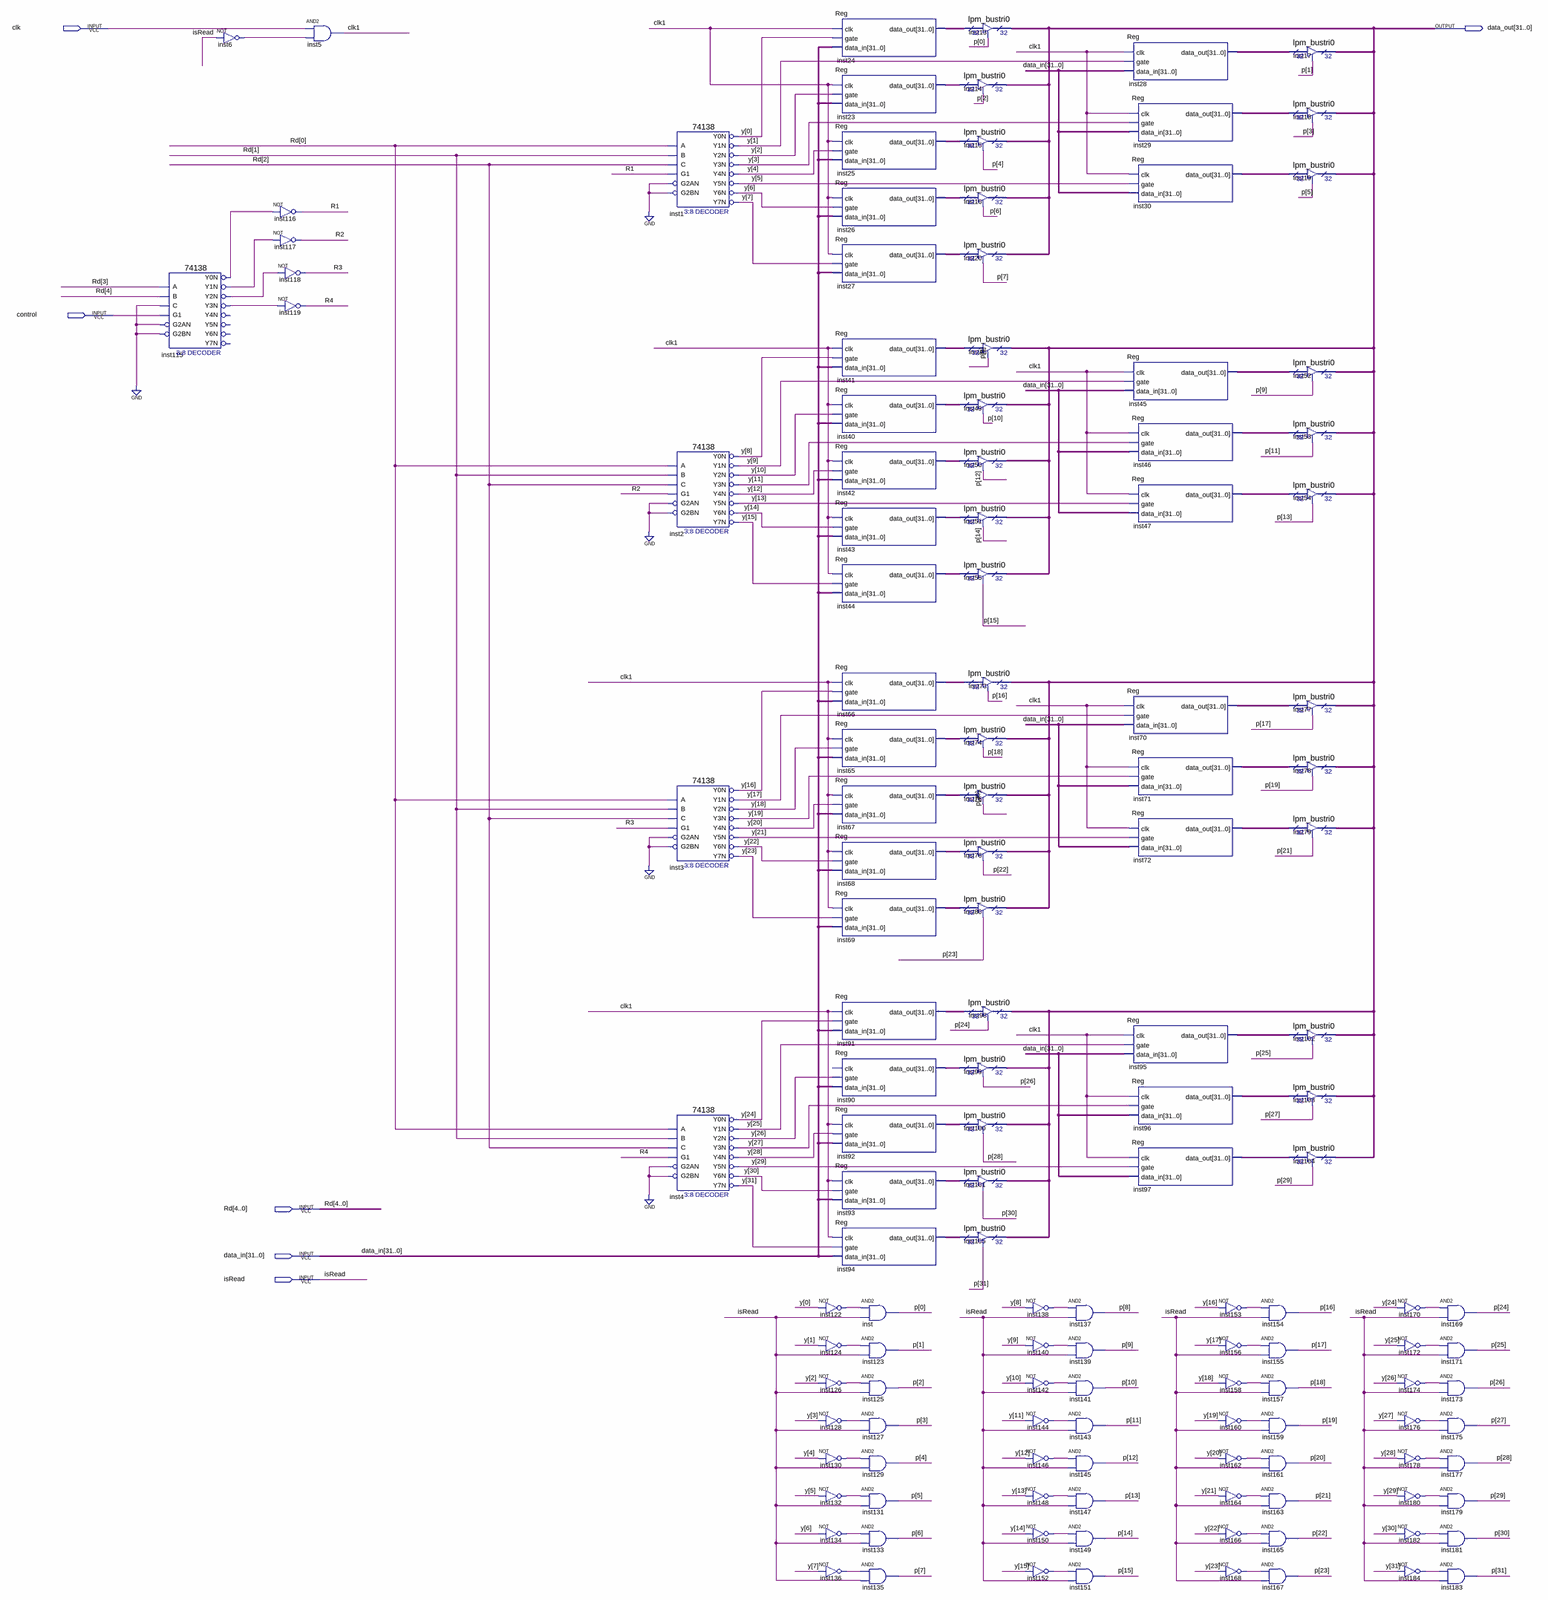
[diagram p0: schematic sheet, whole]
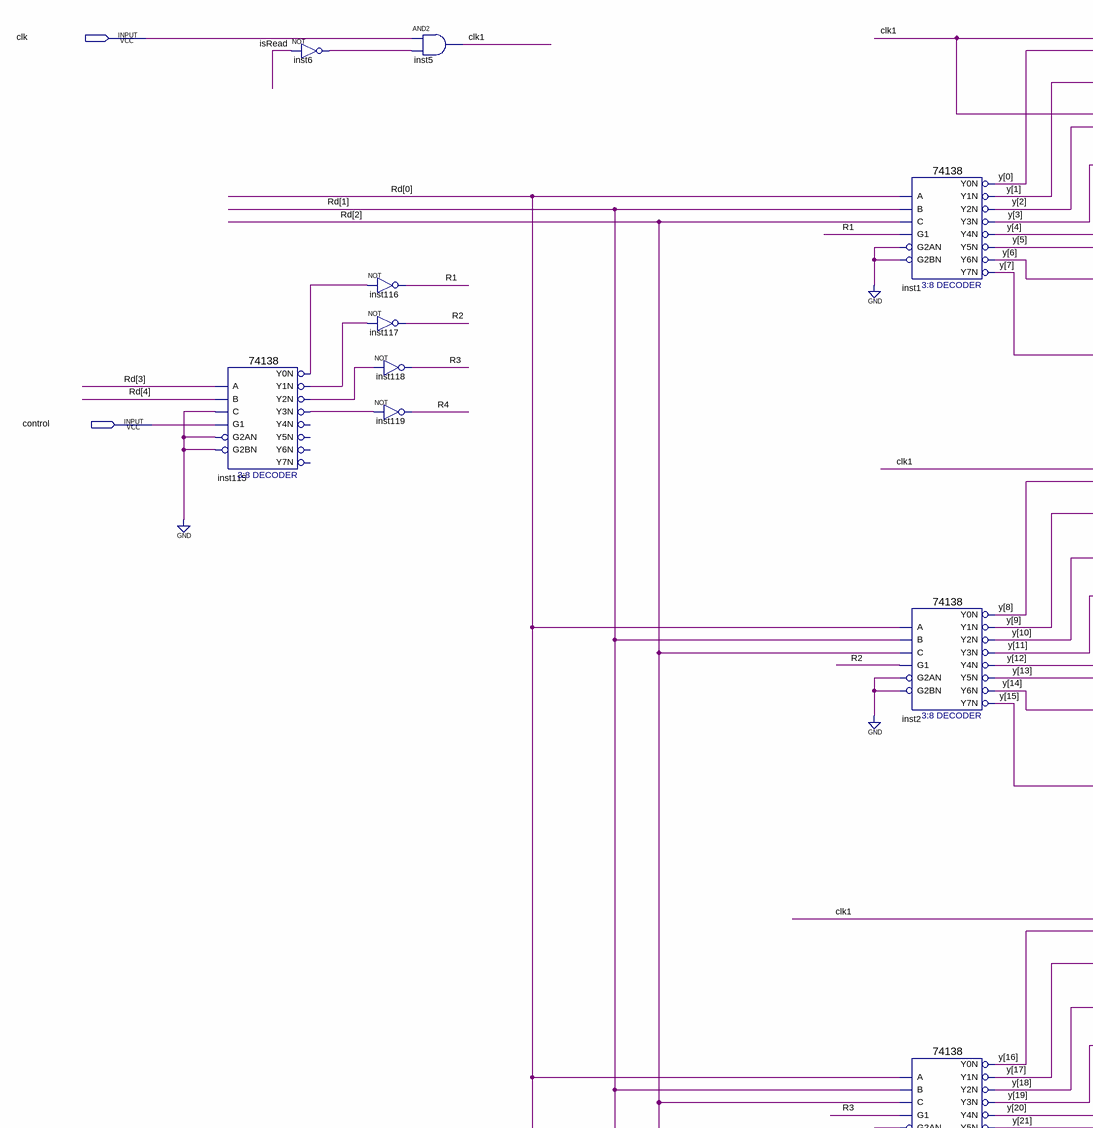
[diagram p1: schematic sheet, upper left part]
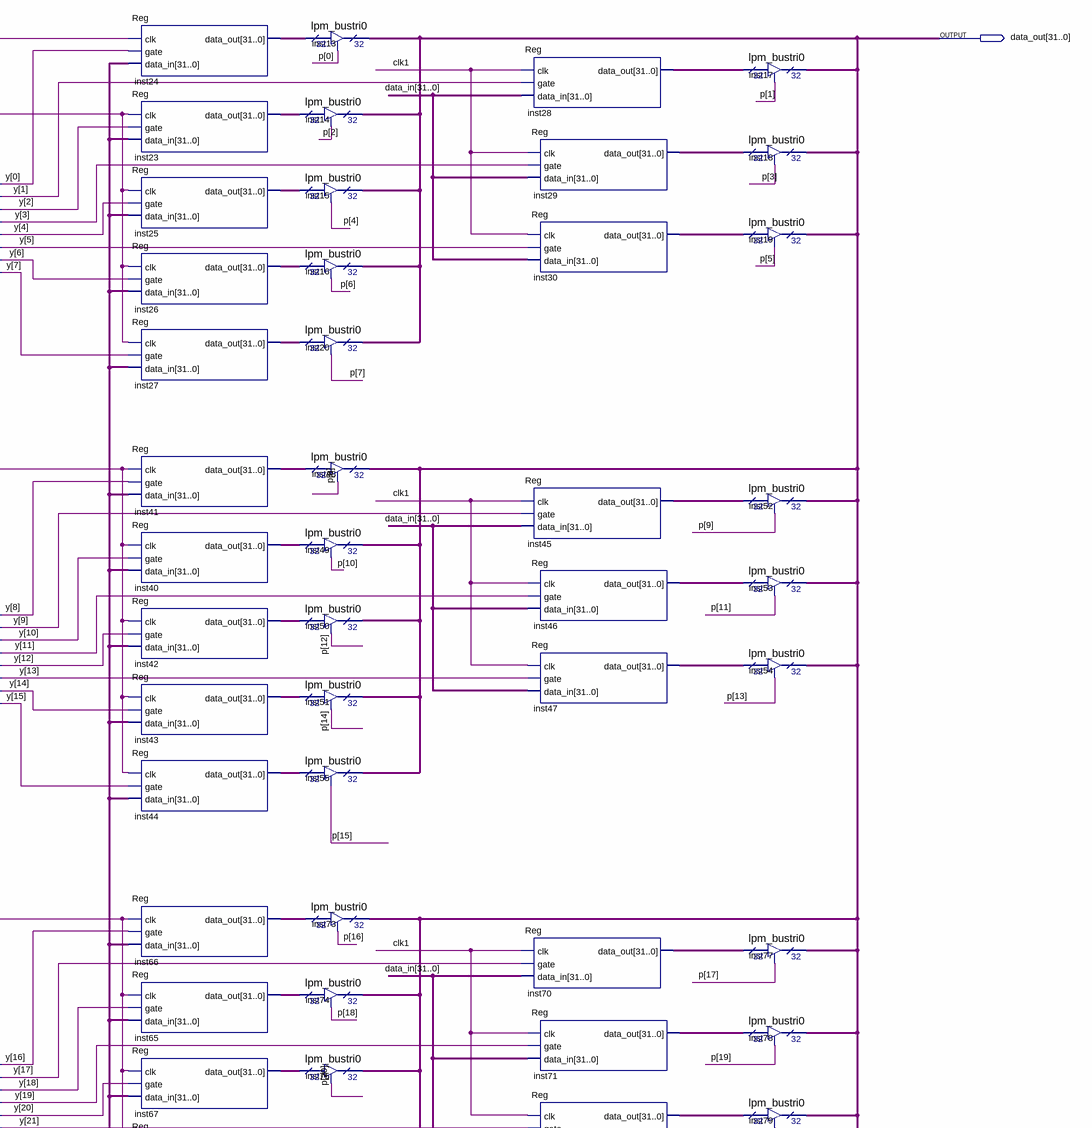
[diagram p2: schematic sheet, upper right part]
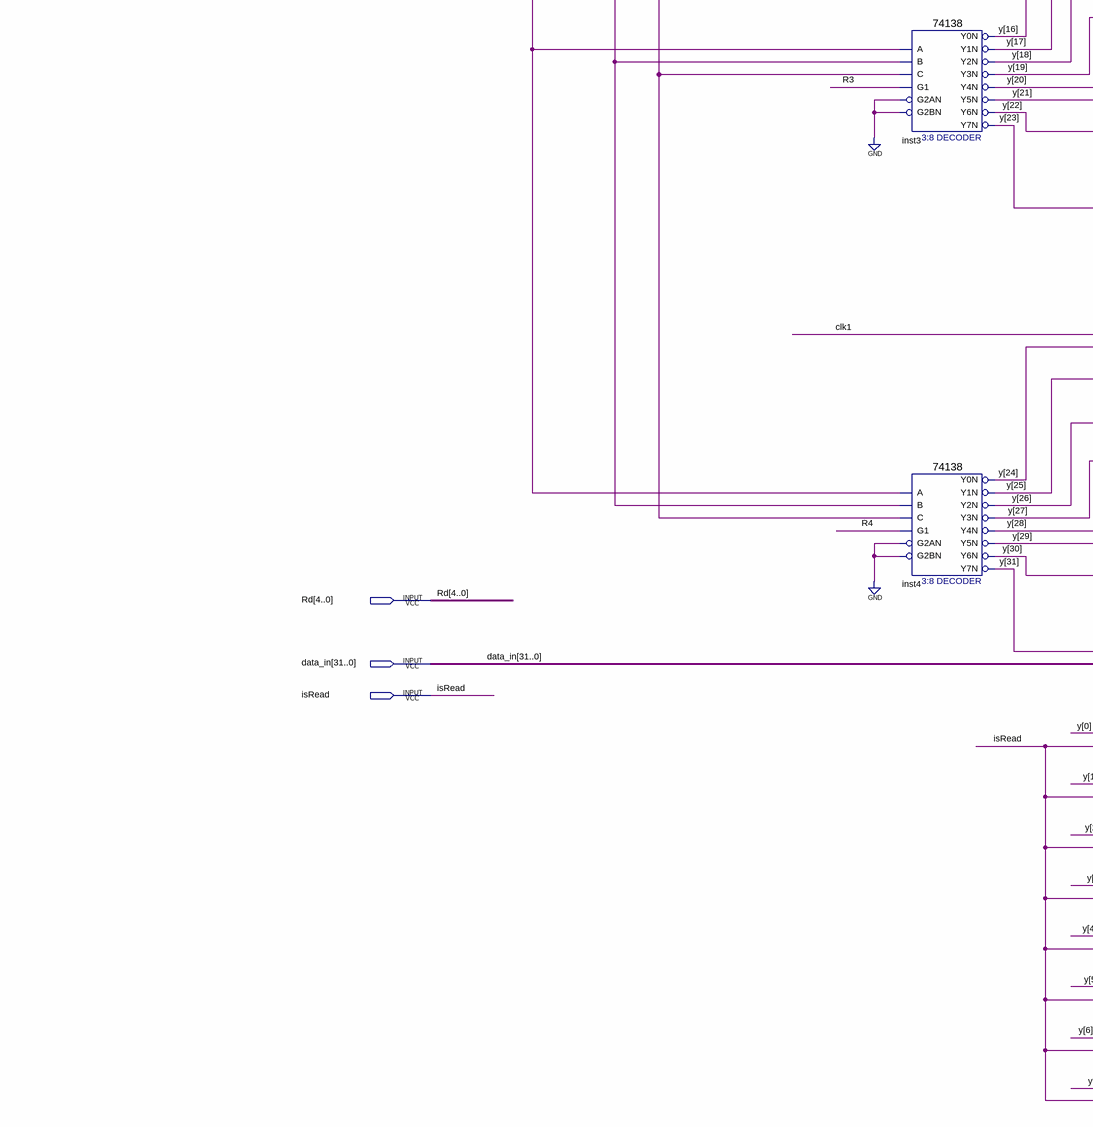
[diagram p3: schematic sheet, lower left part]
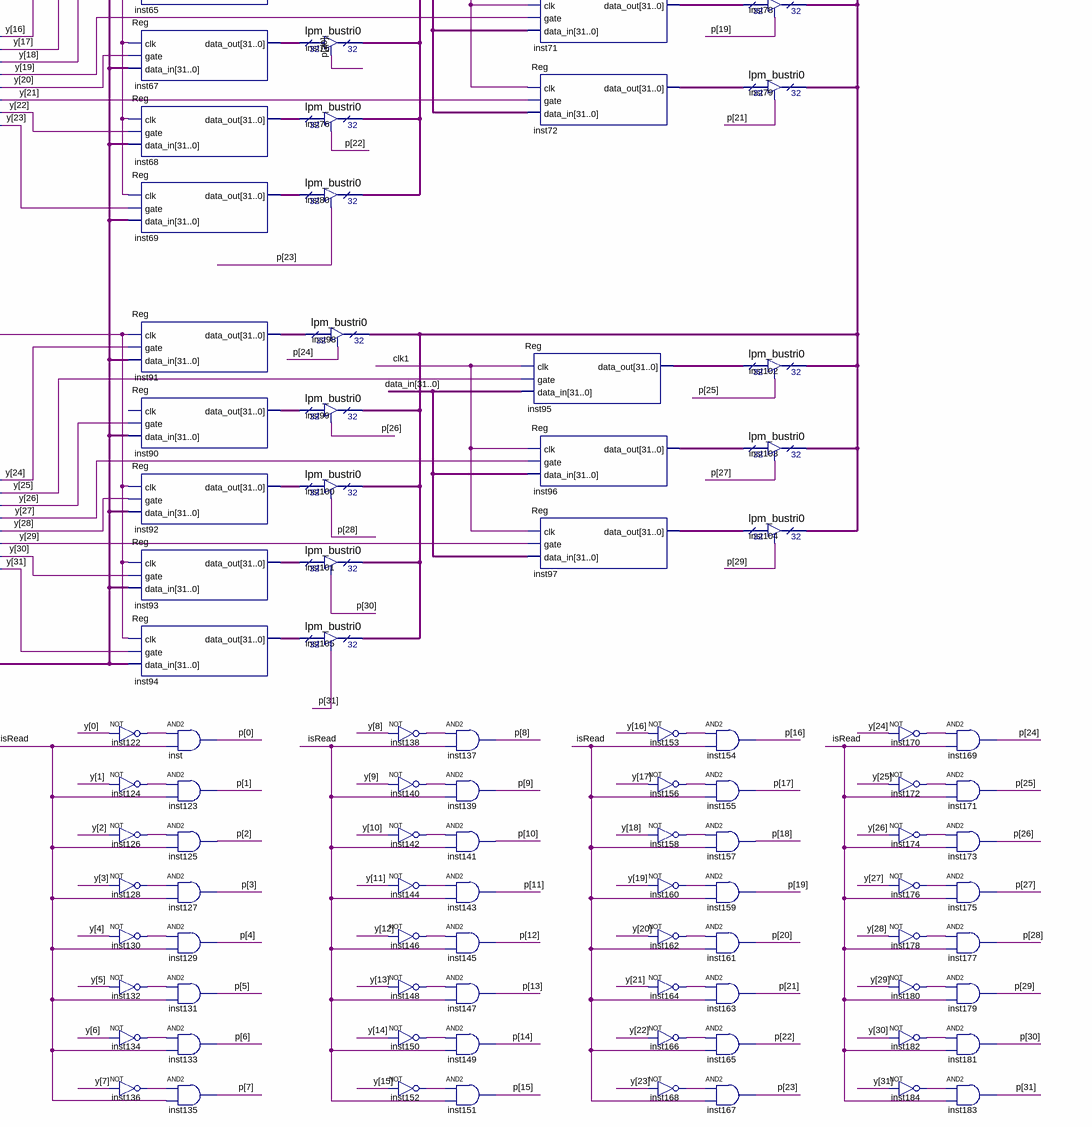
[diagram p4: schematic sheet, lower right part]
// Quartus schematic L_Reg.bdf as structural Verilog: 139 symbols, 6 pins
module L_Reg (
  input  clk,
  input  control,
  input  [4:0] Rd,
  input  [31:0] data_in,
  input  isRead,
  output [31:0] data_out
);

  wire clk1, inst6_out, inst115_y0n, inst115_y1n, inst115_y2n, inst115_y3n, inst122_out, inst124_out,
       inst126_out, inst128_out, inst130_out, inst132_out, inst134_out, inst136_out, inst138_out,
       inst140_out, inst142_out, inst144_out, inst146_out, inst148_out, inst150_out, inst152_out,
       inst153_out, inst156_out, inst158_out, inst160_out, inst162_out, inst164_out, inst166_out,
       inst168_out, inst170_out, inst172_out, inst174_out, inst176_out, inst178_out, inst180_out,
       inst182_out, inst184_out, R1, R2, R3, R4;
  wire [31:0] inst23_data_out, inst24_data_out, inst25_data_out, inst26_data_out, inst27_data_out,
       inst28_data_out, inst29_data_out, inst30_data_out, inst40_data_out, inst41_data_out, inst42_data_out,
       inst43_data_out, inst44_data_out, inst45_data_out, inst46_data_out, inst47_data_out, inst65_data_out,
       inst66_data_out, inst67_data_out, inst68_data_out, inst69_data_out, inst70_data_out, inst71_data_out,
       inst72_data_out, inst90_data_out, inst91_data_out, inst92_data_out, inst93_data_out, inst94_data_out,
       inst95_data_out, inst96_data_out, inst97_data_out, p, y;

  \74138  inst115 (
    .A(Rd[3]), .B(Rd[4]), .G1(control), .C(1'b0), .G2AN(1'b0), .G2BN(1'b0), .Y0N(inst115_y0n),
    .Y1N(inst115_y1n), .Y2N(inst115_y2n), .Y3N(inst115_y3n));  // open: Y4N, Y5N, Y6N, Y7N
  not inst6 (inst6_out, isRead);
  and inst5 (clk1, clk, inst6_out);
  not inst116 (R1, inst115_y0n);
  not inst117 (R2, inst115_y1n);
  not inst118 (R3, inst115_y2n);
  not inst119 (R4, inst115_y3n);
  \74138  inst1 (
    .A(Rd[0]), .B(Rd[1]), .G1(R1), .C(Rd[2]), .G2AN(1'b0), .G2BN(1'b0), .Y0N(y[0]), .Y1N(y[1]), .Y2N(y[2]),
    .Y3N(y[3]), .Y4N(y[4]), .Y5N(y[5]), .Y6N(y[6]), .Y7N(y[7]));
  \74138  inst2 (
    .A(Rd[0]), .B(Rd[1]), .G1(R2), .C(Rd[2]), .G2AN(1'b0), .G2BN(1'b0), .Y0N(y[8]), .Y1N(y[9]), .Y2N(y[10]),
    .Y3N(y[11]), .Y4N(y[12]), .Y5N(y[13]), .Y6N(y[14]), .Y7N(y[15]));
  \74138  inst3 (
    .A(Rd[0]), .B(Rd[1]), .G1(R3), .C(Rd[2]), .G2AN(1'b0), .G2BN(1'b0), .Y0N(y[16]), .Y1N(y[17]),
    .Y2N(y[18]), .Y3N(y[19]), .Y4N(y[20]), .Y5N(y[21]), .Y6N(y[22]), .Y7N(y[23]));
  \74138  inst4 (
    .A(Rd[0]), .B(Rd[1]), .G1(R4), .C(Rd[2]), .G2AN(1'b0), .G2BN(1'b0), .Y0N(y[24]), .Y1N(y[25]),
    .Y2N(y[26]), .Y3N(y[27]), .Y4N(y[28]), .Y5N(y[29]), .Y6N(y[30]), .Y7N(y[31]));
  Reg inst24 (.clk(clk1), .gate(y[0]), .data_in(data_in), .data_out(inst24_data_out));
  Reg inst23 (.clk(clk1), .gate(y[2]), .data_in(data_in), .data_out(inst23_data_out));
  Reg inst25 (.clk(clk1), .gate(y[4]), .data_in(data_in), .data_out(inst25_data_out));
  Reg inst26 (.clk(clk1), .gate(y[6]), .data_in(data_in), .data_out(inst26_data_out));
  Reg inst27 (.clk(clk1), .gate(y[7]), .data_in(data_in), .data_out(inst27_data_out));
  Reg inst41 (.clk(clk1), .gate(y[8]), .data_in(data_in), .data_out(inst41_data_out));
  Reg inst40 (.clk(clk1), .gate(y[10]), .data_in(data_in), .data_out(inst40_data_out));
  Reg inst42 (.clk(clk1), .gate(y[12]), .data_in(data_in), .data_out(inst42_data_out));
  Reg inst43 (.clk(clk1), .gate(y[14]), .data_in(data_in), .data_out(inst43_data_out));
  Reg inst44 (.clk(clk1), .gate(y[15]), .data_in(data_in), .data_out(inst44_data_out));
  Reg inst66 (.clk(clk1), .gate(y[16]), .data_in(data_in), .data_out(inst66_data_out));
  Reg inst65 (.clk(clk1), .gate(y[18]), .data_in(data_in), .data_out(inst65_data_out));
  Reg inst67 (.clk(clk1), .gate(y[20]), .data_in(data_in), .data_out(inst67_data_out));
  Reg inst68 (.clk(clk1), .gate(y[22]), .data_in(data_in), .data_out(inst68_data_out));
  Reg inst69 (.clk(clk1), .gate(y[23]), .data_in(data_in), .data_out(inst69_data_out));
  Reg inst91 (.clk(clk1), .gate(y[24]), .data_in(data_in), .data_out(inst91_data_out));
  Reg inst90 (.gate(y[26]), .data_in(data_in), .data_out(inst90_data_out));  // open: clk
  Reg inst92 (.clk(clk1), .gate(y[28]), .data_in(data_in), .data_out(inst92_data_out));
  Reg inst93 (.clk(clk1), .gate(y[30]), .data_in(data_in), .data_out(inst93_data_out));
  Reg inst94 (.clk(clk1), .gate(y[31]), .data_in(data_in), .data_out(inst94_data_out));
  not inst122 (inst122_out, y[0]);
  not inst124 (inst124_out, y[1]);
  not inst126 (inst126_out, y[2]);
  not inst128 (inst128_out, y[3]);
  not inst130 (inst130_out, y[4]);
  not inst132 (inst132_out, y[5]);
  not inst134 (inst134_out, y[6]);
  not inst136 (inst136_out, y[7]);
  and inst (p[0], inst122_out, isRead);
  and inst123 (p[1], inst124_out, isRead);
  and inst125 (p[2], inst126_out, isRead);
  and inst127 (p[3], inst128_out, isRead);
  and inst129 (p[4], inst130_out, isRead);
  and inst131 (p[5], inst132_out, isRead);
  and inst133 (p[6], inst134_out, isRead);
  and inst135 (p[7], inst136_out, isRead);
  lpm_bustri0 inst13 (.enabledt(p[0]), .data(inst24_data_out), .tridata(data_out));
  lpm_bustri0 inst14 (.enabledt(p[2]), .data(inst23_data_out), .tridata(data_out));
  lpm_bustri0 inst15 (.enabledt(p[4]), .data(inst25_data_out), .tridata(data_out));
  lpm_bustri0 inst16 (.enabledt(p[6]), .data(inst26_data_out), .tridata(data_out));
  lpm_bustri0 inst20 (.enabledt(p[7]), .data(inst27_data_out), .tridata(data_out));
  lpm_bustri0 inst48 (.enabledt(p[8]), .data(inst41_data_out), .tridata(data_out));
  lpm_bustri0 inst49 (.enabledt(p[10]), .data(inst40_data_out), .tridata(data_out));
  lpm_bustri0 inst50 (.enabledt(p[12]), .data(inst42_data_out), .tridata(data_out));
  lpm_bustri0 inst51 (.enabledt(p[14]), .data(inst43_data_out), .tridata(data_out));
  lpm_bustri0 inst55 (.enabledt(p[15]), .data(inst44_data_out), .tridata(data_out));
  lpm_bustri0 inst73 (.enabledt(p[16]), .data(inst66_data_out), .tridata(data_out));
  lpm_bustri0 inst74 (.enabledt(p[18]), .data(inst65_data_out), .tridata(data_out));
  lpm_bustri0 inst75 (.enabledt(p[20]), .data(inst67_data_out), .tridata(data_out));
  lpm_bustri0 inst76 (.enabledt(p[22]), .data(inst68_data_out), .tridata(data_out));
  lpm_bustri0 inst80 (.enabledt(p[23]), .data(inst69_data_out), .tridata(data_out));
  lpm_bustri0 inst98 (.enabledt(p[24]), .data(inst91_data_out), .tridata(data_out));
  lpm_bustri0 inst99 (.enabledt(p[26]), .data(inst90_data_out), .tridata(data_out));
  lpm_bustri0 inst100 (.enabledt(p[28]), .data(inst92_data_out), .tridata(data_out));
  lpm_bustri0 inst101 (.enabledt(p[30]), .data(inst93_data_out), .tridata(data_out));
  lpm_bustri0 inst105 (.enabledt(p[31]), .data(inst94_data_out), .tridata(data_out));
  not inst138 (inst138_out, y[8]);
  not inst140 (inst140_out, y[9]);
  not inst142 (inst142_out, y[10]);
  not inst144 (inst144_out, y[11]);
  not inst146 (inst146_out, y[12]);
  not inst148 (inst148_out, y[13]);
  not inst150 (inst150_out, y[14]);
  not inst152 (inst152_out, y[15]);
  and inst137 (p[8], inst138_out, isRead);
  and inst139 (p[9], inst140_out, isRead);
  and inst141 (p[10], inst142_out, isRead);
  and inst143 (p[11], inst144_out, isRead);
  and inst145 (p[12], inst146_out, isRead);
  and inst147 (p[13], inst148_out, isRead);
  and inst149 (p[14], inst150_out, isRead);
  and inst151 (p[15], inst152_out, isRead);
  Reg inst28 (.clk(clk1), .gate(y[1]), .data_in(data_in), .data_out(inst28_data_out));
  Reg inst29 (.clk(clk1), .gate(y[3]), .data_in(data_in), .data_out(inst29_data_out));
  Reg inst30 (.clk(clk1), .gate(y[5]), .data_in(data_in), .data_out(inst30_data_out));
  Reg inst45 (.clk(clk1), .gate(y[9]), .data_in(data_in), .data_out(inst45_data_out));
  Reg inst46 (.clk(clk1), .gate(y[11]), .data_in(data_in), .data_out(inst46_data_out));
  Reg inst47 (.clk(clk1), .gate(y[13]), .data_in(data_in), .data_out(inst47_data_out));
  Reg inst70 (.clk(clk1), .gate(y[17]), .data_in(data_in), .data_out(inst70_data_out));
  Reg inst71 (.clk(clk1), .gate(y[19]), .data_in(data_in), .data_out(inst71_data_out));
  Reg inst72 (.clk(clk1), .gate(y[21]), .data_in(data_in), .data_out(inst72_data_out));
  Reg inst95 (.clk(clk1), .gate(y[25]), .data_in(data_in), .data_out(inst95_data_out));
  Reg inst96 (.clk(clk1), .gate(y[27]), .data_in(data_in), .data_out(inst96_data_out));
  Reg inst97 (.clk(clk1), .gate(y[29]), .data_in(data_in), .data_out(inst97_data_out));
  not inst153 (inst153_out, y[16]);
  not inst156 (inst156_out, y[17]);
  not inst158 (inst158_out, y[18]);
  not inst160 (inst160_out, y[19]);
  not inst162 (inst162_out, y[20]);
  not inst164 (inst164_out, y[21]);
  not inst166 (inst166_out, y[22]);
  not inst168 (inst168_out, y[23]);
  and inst154 (p[16], inst153_out, isRead);
  and inst155 (p[17], inst156_out, isRead);
  and inst157 (p[18], inst158_out, isRead);
  and inst159 (p[19], inst160_out, isRead);
  and inst161 (p[20], inst162_out, isRead);
  and inst163 (p[21], inst164_out, isRead);
  and inst165 (p[22], inst166_out, isRead);
  and inst167 (p[23], inst168_out, isRead);
  lpm_bustri0 inst17 (.enabledt(p[1]), .data(inst28_data_out), .tridata(data_out));
  lpm_bustri0 inst18 (.enabledt(p[3]), .data(inst29_data_out), .tridata(data_out));
  lpm_bustri0 inst19 (.enabledt(p[5]), .data(inst30_data_out), .tridata(data_out));
  lpm_bustri0 inst52 (.enabledt(p[9]), .data(inst45_data_out), .tridata(data_out));
  lpm_bustri0 inst53 (.enabledt(p[11]), .data(inst46_data_out), .tridata(data_out));
  lpm_bustri0 inst54 (.enabledt(p[13]), .data(inst47_data_out), .tridata(data_out));
  lpm_bustri0 inst77 (.enabledt(p[17]), .data(inst70_data_out), .tridata(data_out));
  lpm_bustri0 inst78 (.enabledt(p[19]), .data(inst71_data_out), .tridata(data_out));
  lpm_bustri0 inst79 (.enabledt(p[21]), .data(inst72_data_out), .tridata(data_out));
  lpm_bustri0 inst102 (.enabledt(p[25]), .data(inst95_data_out), .tridata(data_out));
  lpm_bustri0 inst103 (.enabledt(p[27]), .data(inst96_data_out), .tridata(data_out));
  lpm_bustri0 inst104 (.enabledt(p[29]), .data(inst97_data_out), .tridata(data_out));
  not inst170 (inst170_out, y[24]);
  not inst172 (inst172_out, y[25]);
  not inst174 (inst174_out, y[26]);
  not inst176 (inst176_out, y[27]);
  not inst178 (inst178_out, y[28]);
  not inst180 (inst180_out, y[29]);
  not inst182 (inst182_out, y[30]);
  not inst184 (inst184_out, y[31]);
  and inst169 (p[24], inst170_out, isRead);
  and inst171 (p[25], inst172_out, isRead);
  and inst173 (p[26], inst174_out, isRead);
  and inst175 (p[27], inst176_out, isRead);
  and inst177 (p[28], inst178_out, isRead);
  and inst179 (p[29], inst180_out, isRead);
  and inst181 (p[30], inst182_out, isRead);
  and inst183 (p[31], inst184_out, isRead);
endmodule
